# Altium project VOLT_CONV_PROJECT.PrjPcb
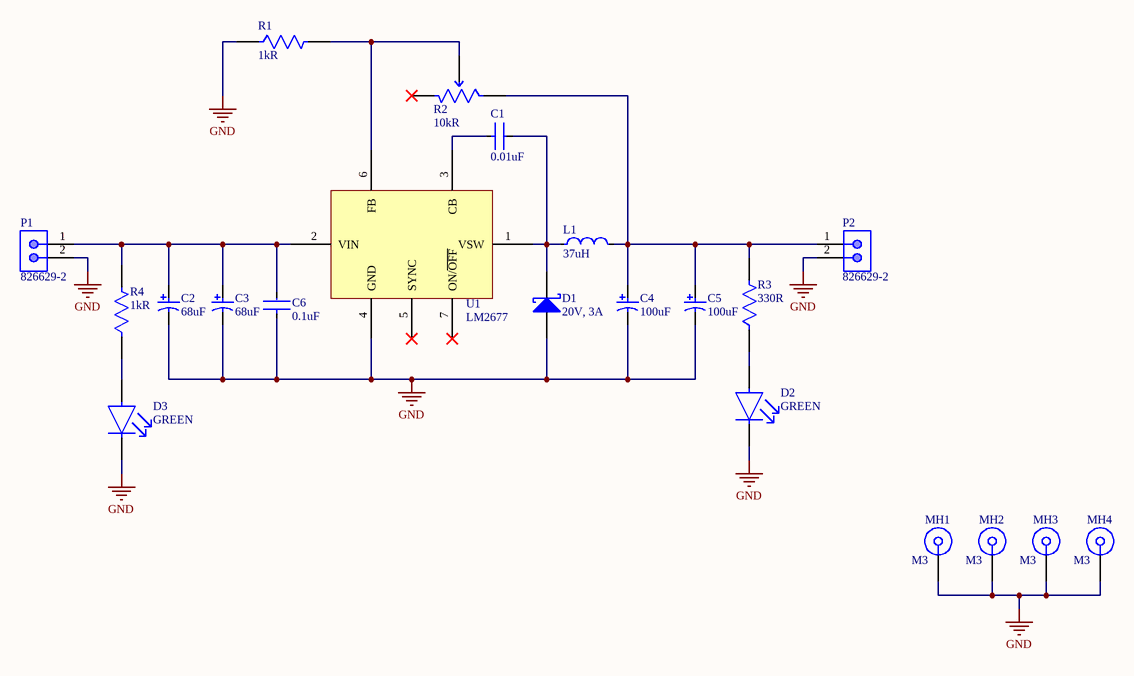
[diagram p0: VOLT_CONV_SCH.SchDoc]
1 sheet, 21 parts. Net scope: global (net labels, ports and power ports of the same name join across sheets).
Board file: VOLT_CONV_PCB.PcbDoc

## Sheet VOLT_CONV_SCH.SchDoc: 5-10V 2A Voltage Converter
size B; DrawnBy: Oon Chu Lip; DocumentNumber: 1; Revision: A; SheetNumber: 1; SheetTotal: 1

### Parts
C1  0.01uF  [CAP_1206_AVX_1206]
C2  68uF  [CAP_2917_KEMT_T495_D]
C3  68uF  [CAP_2917_KEMT_T495_D]
C4  100uF  [CAP_2917_AVX_7343_31]
C5  100uF  [CAP_2917_AVX_7343_31]
C6  0.1uF  [CAP_1206_AVX_1206]
D1  20V, 3A  [DIO_SCHOTTKY_ON_SMC_403AG]
D2  GREEN  [DIO_1206_ LTST_C150]
D3  GREEN  [DIO_1206_ LTST_C150]
L1  37uH  [IND_NON_STD_LCI44]
MH1  M3  [MH_M3]
MH2  M3  [MH_M3]
MH3  M3  [MH_M3]
MH4  M3  [MH_M3]
P1  826629-2  [CONN_HEADER_MALE_0.1_2x1]
P2  826629-2  [CONN_HEADER_MALE_0.1_2x1]
R1  1kR  [RES_1206_YAGEO_RC_1206]
R2  10kR  [RES_VAR_BRN_3214X]
R3  330R  [RES_1206_SE_RMCF1206]
R4  1kR  [RES_1206_YAGEO_RC_1206]
U1  LM2677  [IC_TO_263_7_KTW0007B]

### Nets
GND: C2.2 C3.2 C4.2 C5.2 C6.1 D1.A D2.2 D3.2 MH1.1 MH2.1 MH3.1 MH4.1 P1.2 P2.2 R1.1 U1.4(GND)
NetC1_1: C1.1 U1.3(CB)
NetC1_2: C1.2 D1.K L1.1 U1.1(VSW)
NetC2_1: C2.1 C3.1 C6.2 P1.1 R4.2 U1.2(VIN)
NetC4_1: C4.1 C5.1 L1.2 P2.1 R2.1(CCW) R3.2
NetD2_1: D2.1 R3.1
NetD3_1: D3.1 R4.1
NetR1_2: R1.2 R2.2(WIPER) U1.6(FB)

Not connected (* = marked no-connect by the designer): R2 3(CW)*; U1 5(SYNC)* 7(ON/~{OFF})*

### Library data of the parts
C1 = CAP_0.01uF_10%_50V: ±10% 50V Ceramic Capacitor X7R 1206 (3216 Metric); Manufacturer: AVX Corporation; Manufacturer Part Number: 12065C103KAT2A; Supplier 1: Digi-Key; Supplier Part Number 1: 478-1542-1-ND; Case/Package: 1206 (3216 Metric)
C2 C3 = PCAP_68uF_10%_20V: Molded Tantalum Capacitors 2917 (7343 Metric) 300mOhm; Manufacturer: KEMET; Manufacturer Part Number: T495D686K020ATE300; Supplier 1: Digi-Key; Supplier Part Number 1: 399-11095-1-ND; Case/Package: 2917 (7343 Metric)
C4 C5 = PCAP_100uF_10%_16V: Molded Tantalum Capacitors 2917 (7343 Metric) 125mOhm; Manufacturer: AVX Corporation; Manufacturer Part Number: TPSD107K016R0125; Supplier 1: Digi-Key; Supplier Part Number 1: 478-1778-1-ND; Case/Package: 2917 (7343 Metric)
C6 = CAP_0.1uF_10%_50V: ±10% 50V Ceramic Capacitor X8R 1206 (3216 Metric); Manufacturer: AVX Corporation; Manufacturer Part Number: 12065F104K4T2A; Supplier 1: Digi-Key; Supplier Part Number 1: 478-3618-1-ND; Case/Package: 1206 (3216 Metric)
D1 = DIO_SCHOTTKY_20V_3A: Diode Schottky 3A Surface Mount SMC (DO-214AB); Manufacturer: ON Semiconductor; Manufacturer Part Number: SS32; Supplier 1: Digi-Key; Supplier Part Number 1: SS32CT-ND; Case/Package: DO-214AB, SMC
D2 D3 = DIO_LED_GREEN: LED GREEN CLEAR CHIP SMD; Manufacturer: Lite-On Inc.; Manufacturer Part Number: LTST-C150GKT; Supplier 1: Digi-Key; Supplier Part Number 1: 160-1169-1-ND; Case/Package: 1206 (3216 Metric)
L1 = IND_37uH_20%_2.24A: Shielded Toroidal Inductor 100mOhm Nonstandard; Manufacturer: Pulse Electronics Power; Manufacturer Part Number: PE-53932SNL; Supplier 1: Digi-Key; Supplier Part Number 1: 553-1415-ND; Case/Package: Nonstandard
MH1-MH4 = MH_M3: M3 Mounting Hole
P1 P2 = CONN_VERT_HEADER_MALE_0.1_2x1: CONN HEADER VERT 2POS 2.54MM; Manufacturer: TE Connectivity AMP Connectors; Manufacturer Part Number: 826629-2; Supplier 1: Digi-Key; Supplier Part Number 1: A105107-ND; Case/Package: Header, Breakaway
R1 R4 = RES_1kR_1%_0.25W: ±1% 0.25W, 1/4W Chip Resistor 1206 (3216 Metric) Moisture Resistant Thick Film; Manufacturer: Yageo; Manufacturer Part Number: RC1206FR-071KL; Supplier 1: Digi-Key; Supplier Part Number 1: 311-1.00KFRCT-ND; Case/Package: 1206 (3216 Metric)
R2 = RES_VAR_10kR_10%_0.25W: 0.25W, 1/4W Gull Wing Surface Mount Trimmer Potentiometer Cermet Turn Top Adjustment; Manufacturer: Bourns Inc.; Manufacturer Part Number: 3214X-1-103E; Supplier 1: Digi-Key; Supplier Part Number 1: 3214X-1-103ECT-ND; Case/Package: Surface Mount
R3 = RES_330R_5%_0.25W: ±5% 0.25W, 1/4W Chip Resistor 1206 (3216 Metric) Automotive AEC-Q200 Thick Film; Manufacturer: Stackpole Electronics Inc; Manufacturer Part Number: RMCF1206JT330R; Supplier 1: Digi-Key; Supplier Part Number 1: RMCF1206JT330RCT-ND; Case/Package: 1206 (3216 Metric)
U1 = IC_LM2677: Buck Switching Regulator IC Positive Adjustable 1.21V 1 Output 5A TO-263-8, D²Pak (7 Leads + Tab), TO-263CA; Manufacturer: Texas Instruments; Manufacturer Part Number: LM2677S-ADJ/NOPB; Supplier 1: Digi-Key; Supplier Part Number 1: LM2677S-ADJ/NOPB-ND; Case/Package: TO-263-8, D²Pak (7 Leads + Tab), TO-263CA